# Altium project Cube Brain.PrjPcb
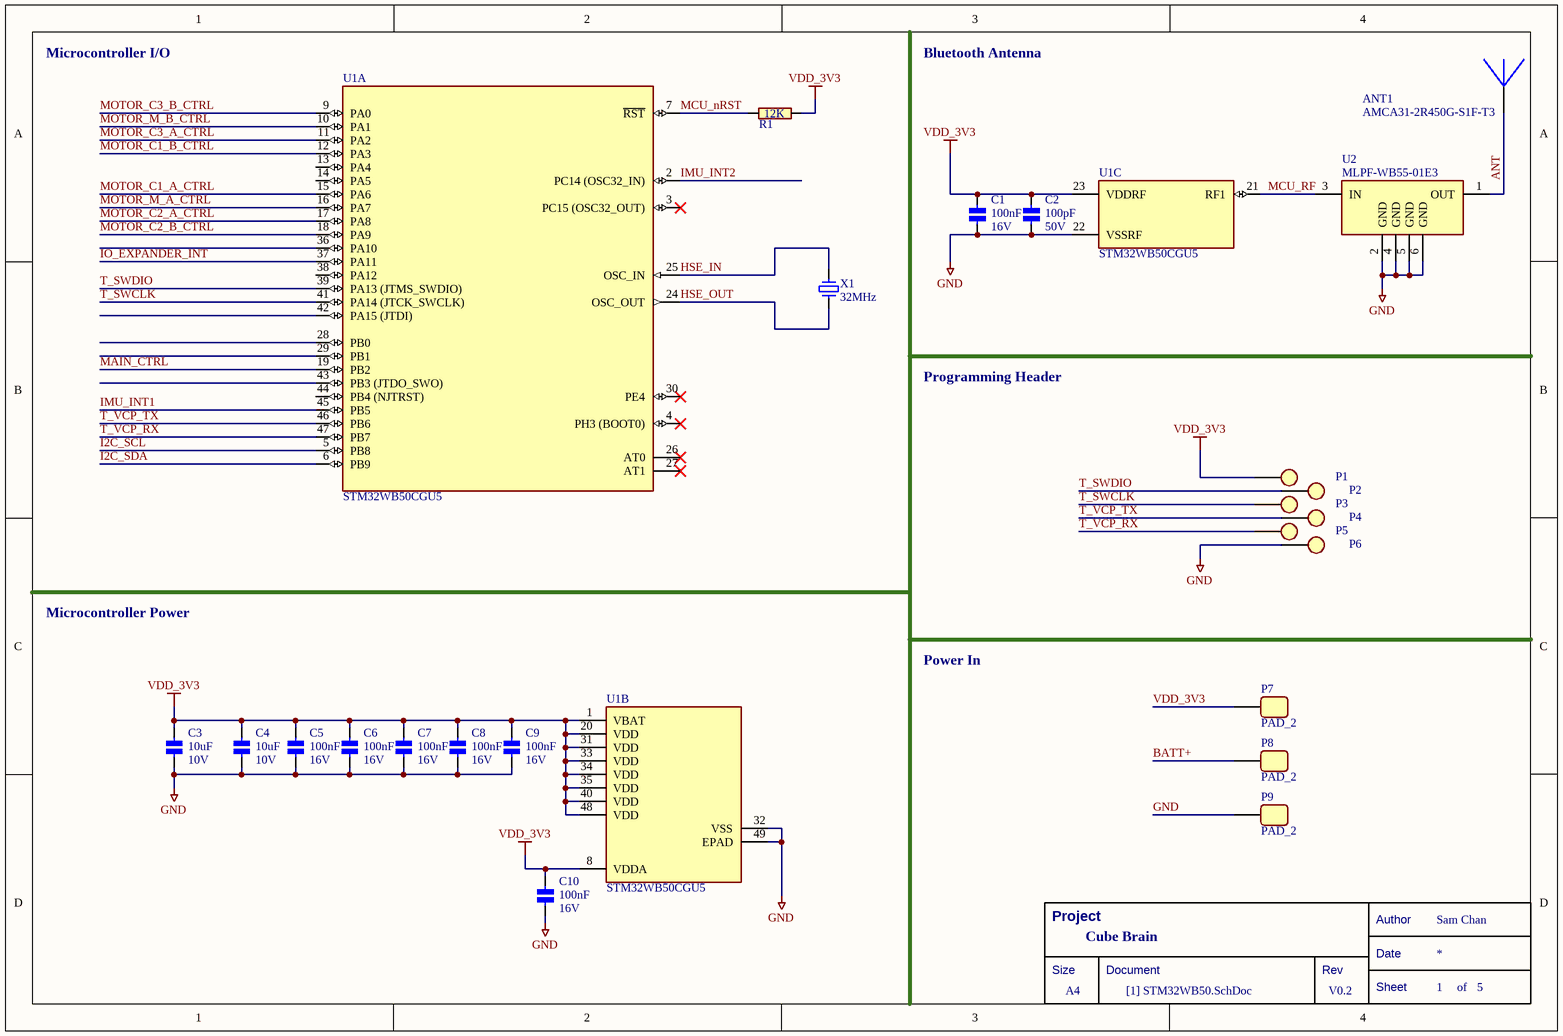
[diagram p0: [1] STM32WB50.SchDoc]
Project: Cube Brain; VersionRevision: V0.2
2 sheets, 29 parts. Net scope: global (net labels, ports and power ports of the same name join across sheets).
Board file: Cube Brain.PcbDoc
Sheets:
  [1] STM32WB50.SchDoc
  [3] IMU.SchDoc

## Sheet [1] STM32WB50.SchDoc
size A4; DocumentNumber: 1; SheetNumber: 1; SheetTotal: 5

### Parts
(Parts that share a designator on the sheet are numbered #1, #2 ... from top to bottom, then left to right.)
*#1  Title Block  (value not drawn)  (graphical)
ANT1  AMCA31-2R450G-S1F-T3  [AMCA31-2R450G-S1F-T3]
C1  Voltage - Rated: 16V  [CAPC0402X05N]  (hidden comment: 100nF)
C2  Voltage - Rated: 50V  [CAPC0402X05N]  (hidden comment: 100pF)
C3  Voltage - Rated: 10V  [CAPC0402X05N]  (hidden comment: 10uF)
C4  Voltage - Rated: 10V  [CAPC0402X05N]  (hidden comment: 10uF)
C5  Voltage - Rated: 16V  [CAPC0402X05N]  (hidden comment: 100nF)
C6  Voltage - Rated: 16V  [CAPC0402X05N]  (hidden comment: 100nF)
C7  Voltage - Rated: 16V  [CAPC0402X05N]  (hidden comment: 100nF)
C8  Voltage - Rated: 16V  [CAPC0402X05N]  (hidden comment: 100nF)
C9  Voltage - Rated: 16V  [CAPC0402X05N]  (hidden comment: 100nF)
C10  Voltage - Rated: 16V  [CAPC0402X05N]  (hidden comment: 100nF)
P1  PAD_3  [R_PAD]  (value not drawn)  (no BOM)
P2  PAD_3  [R_PAD]  (value not drawn)  (no BOM)
P3  PAD_3  [R_PAD]  (value not drawn)  (no BOM)
P4  PAD_3  [R_PAD]  (value not drawn)  (no BOM)
P5  PAD_3  [R_PAD]  (value not drawn)  (no BOM)
P6  PAD_3  [R_PAD]  (value not drawn)  (no BOM)
P7  PAD_2  [BATT_PAD]  (no BOM)
P8  PAD_2  [BATT_PAD]  (no BOM)
P9  PAD_2  [BATT_PAD]  (no BOM)
R1  12K  [RESC0402X04N]
U1  STM32WB50CGU5  [STM32WB50CGU5]  (parts A,B,C of 3)
U2  MLPF-WB55-01E3  [MLPF-WB55-01E3]
X1  32MHz  [XRCGB32M000F1H01R0]

### Nets
GND: C1.2 C2.2 C3.2 C4.2 C5.2 C6.2 C7.2 C8.2 C9.2 C10.2 P6.1 P9.1 U1.22(VSSRF) U1.32(VSS) U1.49(EPAD) U2.2(GND) U2.4(GND) U2.5(GND) U2.6(GND)
VDD_3V3: C1.1 C2.1 C3.1 C4.1 C5.1 C6.1 C7.1 C8.1 C9.1 C10.1 P1.1 P7.1 R1.2 U1.1(VBAT) U1.8(VDDA) U1.20(VDD) U1.23(VDDRF) U1.31(VDD) U1.33(VDD) U1.34(VDD) U1.35(VDD) U1.40(VDD) U1.48(VDD)
ANT: ANT1.1 U2.1(OUT)
BATT+: P8.1
HSE_IN: U1.25(OSC_IN) X1.3
HSE_OUT: U1.24(OSC_OUT) X1.1
I2C_SCL: U1.5(PB8)
I2C_SDA: U1.6(PB9)
IMU_INT1: U1.45(PB5)
IMU_INT2: U1.2(PC14_(OSC32_IN))
IO_EXPANDER_INT: U1.37(PA11)
MAIN_CTRL: U1.19(PB2)
MCU_nRST: R1.1 U1.7(~{RST})
MCU_RF: U1.21(RF1) U2.3(IN)
MOTOR_C1_A_CTRL: U1.15(PA6)
MOTOR_C1_B_CTRL: U1.12(PA3)
MOTOR_C2_A_CTRL: U1.17(PA8)
MOTOR_C2_B_CTRL: U1.18(PA9)
MOTOR_C3_A_CTRL: U1.11(PA2)
MOTOR_C3_B_CTRL: U1.9(PA0)
MOTOR_M_A_CTRL: U1.16(PA7)
MOTOR_M_B_CTRL: U1.10(PA1)
T_SWCLK: P3.1 U1.41(PA14_(JTCK_SWCLK))
T_SWDIO: P2.1 U1.39(PA13_(JTMS_SWDIO))
T_VCP_RX: P5.1 U1.47(PB7)
T_VCP_TX: P4.1 U1.46(PB6)

Not connected (* = marked no-connect by the designer): U1 3(PC15_(OSC32_OUT))* 4(PH3_(BOOT0))* 13(PA4) 14(PA5) 26(AT0)* 27(AT1)* 28(PB0) 29(PB1) 30(PE4)* 36(PA10) 38(PA12) 42(PA15_(JTDI)) 43(PB3_(JTDO_SWO)) 44(PB4_(NJTRST))

### Notes on the sheet
- Microcontroller I/O
- Bluetooth Antenna
- Programming Header
- Microcontroller Power
- Power In
- (in symbol Title Block) Project; Author; Sam Chan; Date; Size; Document; Rev; A4; Sheet; of

### Library data of the parts
*#1 = Title Block: Standard Title Block
ANT1 = AMCA31-2R450G-S1F-T3: RF ANT 2.4GHZ CHIP SOLDER SMD; Manufacturer: Abracon LLC; Categories: RF Antennas; Case: 3.2X1.6X1.2mm; Manufacturer Part Number: AMCA31-2R450G-S1F-T3; Supplier 1: Digi-Key; Supplier Part Number 1: 535-14095-1-ND
C1 C5-C10 = CER 100NF 16V: CAP CER 0.1UF 16V X7R 0402; Manufacturer: Samsung Electro-Mechanics; Manufacturer Part Number: CL05B104KO5NNNC; Category: Capacitors; Supplier 1: LCSC; Supplier Part Number 1: C1525; Package / Case: 0402; Capacitance: 100nF
C2 = CER 100PF 50V: CAP CER 100PF 50V C0G/NP0 0402; Manufacturer: Samsung Electro-Mechanics; Manufacturer Part Number: CL05C101JB5NNNC; Category: Capacitors; Supplier 1: LCSC; Supplier Part Number 1: C26409; Package / Case: 0402; Capacitance: 100pF
C3 C4 = CER 10UF 10V: CAP CER 10UF 10V X5R 0402; Manufacturer: Murata Electronics; Manufacturer Part Number: GRM155R61A106ME44D; Category: Capacitors; Supplier 1: LCSC; Supplier Part Number 1: C77000; Package / Case: 0402; Capacitance: 10uF
P1-P6 = PAD_3: a Round Pad
P7-P9 = PAD_2: a Pad
R1 = RES 12K: RES SMD 12K OHM 1% 1/16W 0402; Manufacturer: YAGEO; Manufacturer Part Number: RC0402FR-0712KL; Category: Resistors; Package / Case: 0402; Supplier 1: LCSC; Supplier Part Number 1: C114760; Resistance: 12K
U1 = STM32WB50CGU5: ULTRA-LOW-POWER DUAL CORE ARM CO; Manufacturer: STMicroelectronics; Categories: RF Transceiver ICs; Case: 48-UFQFN Exposed Pad; Supplier 1: Digi-Key; Supplier Part Number 1: 497-STM32WB50CGU5-ND; Manufacturer Part Number: STM32WB50CGU5
U2 = MLPF-WB55-01E3: RF FILTER LOW PASS 2.45GHZ 6SMD; Manufacturer: STMicroelectronics; Categories: RF Filters; Frequency: 2.45GHz Center; Bandwidth: 100MHz; Case: 6-SMD, No Lead; Manufacturer Part Number: MLPF-WB55-01E3; Supplier 1: Digi-Key; Supplier Part Number 1: 497-19088-1-ND
X1 = XRCGB32M000F1H01R0: 2.0X1.6X0.65MM 32MHZ CRYSTAL; Manufacturer: Murata Electronics; Categories: Crystals; Case: SMD; Manufacturer Part Number: XRCGB32M000F1H01R0; Supplier 1: Digi-Key; Supplier Part Number 1: 490-18334-1-ND

## Sheet [3] IMU.SchDoc
size A4; DocumentNumber: 3; SheetNumber: 3; SheetTotal: 5
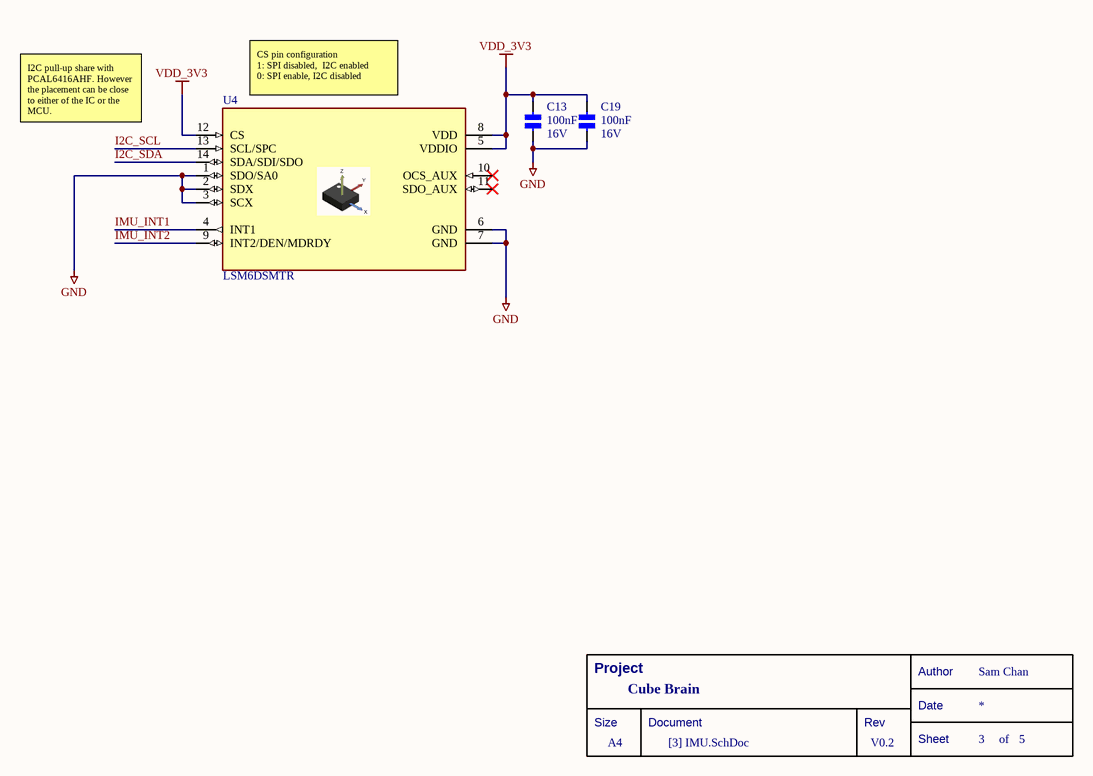
[diagram p1: [3] IMU.SchDoc]

### Parts
(Parts that share a designator on the sheet are numbered #1, #2 ... from top to bottom, then left to right.)
*#2  Title Block  (value not drawn)  (graphical)
C13  Voltage - Rated: 16V  [CAPC0402X05N]  (hidden comment: 100nF)
C19  Voltage - Rated: 16V  [CAPC0402X05N]  (hidden comment: 100nF)
U4  LSM6DSMTR  [LSM6DSMTR]

### Nets
GND: C13.2 C19.2 U4.1(SDO/SA0) U4.2(SDX) U4.3(SCX) U4.6(GND) U4.7(GND)
VDD_3V3: C13.1 C19.1 U4.5(VDDIO) U4.8(VDD) U4.12(CS)
I2C_SCL: U4.13(SCL/SPC)
I2C_SDA: U4.14(SDA/SDI/SDO)
IMU_INT1: U4.4(INT1)
IMU_INT2: U4.9(INT2/DEN/MDRDY)

Not connected (* = marked no-connect by the designer): U4 10(OCS_AUX)* 11(SDO_AUX)*

### Notes on the sheet
- I2C pull-up share with PCAL6416AHF. However the placement can be close to either of the IC or the MCU.
- (near U4) CS pin configuration
  1: SPI disabled,  I2C enabled
  0: SPI enable, I2C disabled
- (in symbol Title Block) Project; Author; Sam Chan; Date; Size; Document; Rev; A4; Sheet; of

### Library data of the parts
*#2 = Title Block: Standard Title Block
C13 C19 = CER 100NF 16V: as C1 on sheet [1] STM32WB50; Category: Capacitors; Supplier 1: LCSC; Supplier Part Number 1: C1525; Package / Case: 0402; Capacitance: 100nF
U4 = LSM6DSMTR: IMU ACCEL/GYRO I2C/SPI 14LGA; Manufacturer: STMicroelectronics; Categories: IMUs (Inertial Measurement Units); Case: 14-VFLGA Module; Manufacturer Part Number: LSM6DSMTR; Supplier 1: Digi-Key; Supplier Part Number 1: 497-16696-1-ND

## Nets that join several sheets
GND: [1] STM32WB50 (19 pins), [3] IMU (7 pins)
VDD_3V3: [1] STM32WB50 (23 pins), [3] IMU (5 pins)
I2C_SCL: [1] STM32WB50 (U1.5), [3] IMU (U4.13)
I2C_SDA: [1] STM32WB50 (U1.6), [3] IMU (U4.14)
IMU_INT1: [1] STM32WB50 (U1.45), [3] IMU (U4.4)
IMU_INT2: [1] STM32WB50 (U1.2), [3] IMU (U4.9)